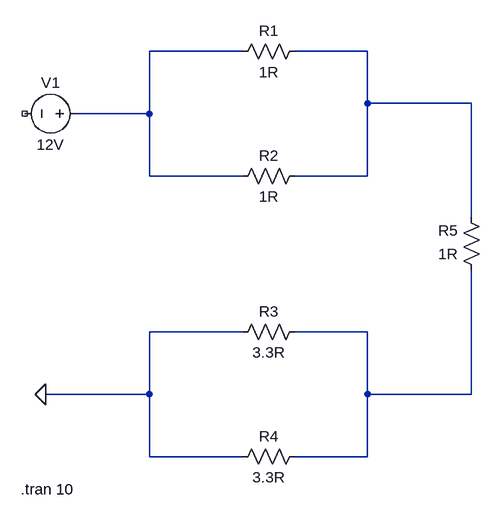
[diagram p0: schematic Emre.asc]
Emre.asc, the LTspice schematic file:
Version 4
SHEET 1 880 680
WIRE 288 -336 144 -336
WIRE 480 -336 368 -336
WIRE 480 -256 480 -336
WIRE 640 -256 480 -256
WIRE 144 -240 144 -336
WIRE 144 -240 32 -240
WIRE 144 -144 144 -240
WIRE 288 -144 144 -144
WIRE 480 -144 480 -256
WIRE 480 -144 368 -144
WIRE 640 -80 640 -256
WIRE 288 96 144 96
WIRE 480 96 368 96
WIRE 144 192 144 96
WIRE 144 192 -16 192
WIRE 480 192 480 96
WIRE 640 192 640 0
WIRE 640 192 480 192
WIRE 144 288 144 192
WIRE 288 288 144 288
WIRE 480 288 480 192
WIRE 480 288 368 288
FLAG -16 192 0
SYMBOL res 384 -352 R90
WINDOW 0 0 56 VBottom 2
WINDOW 3 32 56 VTop 2
SYMATTR InstName R1
SYMATTR Value 1R
SYMBOL res 384 -160 R90
WINDOW 0 0 56 VBottom 2
WINDOW 3 32 56 VTop 2
SYMATTR InstName R2
SYMATTR Value 1R
SYMBOL res 384 80 R90
WINDOW 0 0 56 VBottom 2
WINDOW 3 32 56 VTop 2
SYMATTR InstName R3
SYMATTR Value 3.3R
SYMBOL res 384 272 R90
WINDOW 0 0 56 VBottom 2
WINDOW 3 32 56 VTop 2
SYMATTR InstName R4
SYMATTR Value 3.3R
SYMBOL res 656 16 R180
WINDOW 0 36 76 Left 2
WINDOW 3 36 40 Left 2
SYMATTR InstName R5
SYMATTR Value 1R
SYMBOL voltage 48 -240 R90
WINDOW 0 -32 56 VBottom 2
WINDOW 3 32 56 VTop 2
WINDOW 123 0 0 Left 0
WINDOW 39 0 0 Left 0
SYMATTR InstName V1
SYMATTR Value 12V
TEXT -54 338 Left 2 !.tran 10

The netlist it stands for:
* Emre.asc
R1 N002 N001 1R
R2 N002 N001 1R
R3 N003 0 3.3R
R4 N003 0 3.3R
R5 N003 N002 1R
V1 N001 NC_01 12V
.tran 10
.backanno
.end